# EAGLE design wifi_shield (EAGLE 9.6.2)
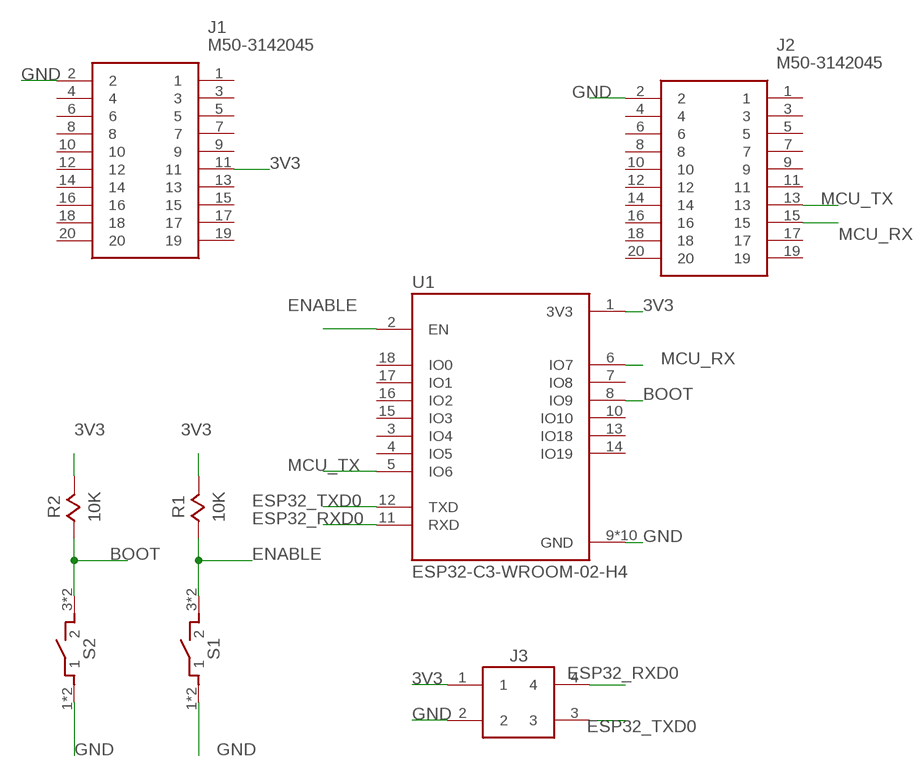
[diagram p0: schematic, sheet 1]

## Parts
J1  M50-3142045  [M503142045]
J2  M50-3142045  [M503142045]
J3  MALE_HEADER_4X1  [4X1_HEADER]
R1  10K  RESISTOR  [0805]
R2  10K  RESISTOR  [0805]
S1  TACTILE-SWITCH  [TACTILE-SWITCH]
S2  TACTILE-SWITCH  [TACTILE-SWITCH]
U1  ESP32-C3-WROOM-02-H4  [MODULE_ESP32-C3-WROOM-02-H4]

## Nets
3V3: J1.11 J3.1 R1.2 R2.2 U1.1(3V3)
BOOT: R2.1 S2.3 S2.4 U1.8(IO9)
ENABLE: R1.1 S1.3 S1.4 U1.2(EN)
ESP32_RXD0: J3.4 U1.11(RXD)
ESP32_TXD0: J3.3 U1.12(TXD)
GND: J1.2 J2.2 J3.2 S1.1 S1.2 S2.1 S2.2 U1.9(GND) U1.19(GND) U1.20(GND) U1.21(GND) U1.22(GND) U1.23(GND) U1.24(GND) U1.25(GND) U1.26(GND) U1.27(GND)
MCU_RX: J2.15 U1.6(IO7)
MCU_TX: J2.13 U1.5(IO6)
Unconnected: J1.1 J1.3 J1.4 J1.5 J1.6 J1.7 J1.8 J1.9 J1.10 J1.12 J1.13 J1.14 J1.15 J1.16 J1.17 J1.18 J1.19 J1.20 J2.1 J2.3 J2.4 J2.5 J2.6 J2.7 J2.8 J2.9 J2.10 J2.11 J2.12 J2.14 J2.16 J2.17 J2.18 J2.19 J2.20 U1.3(IO4) U1.4(IO5) U1.7(IO8) U1.10(IO10) U1.13(IO18) U1.14(IO19) U1.15(IO3) U1.16(IO2) U1.17(IO1) U1.18(IO0)

## Library data of the parts
J1 J2 = esp32_shield:M50-3142045: Headers & Wire Housings 20 WAY SIL VERT SMT SKT Source: Datasheet <https://componentsearchengine.com/Datasheets/1/M50-3142045.pdf>; DESCRIPTION: Headers & Wire Housings 20 WAY SIL VERT SMT SKT; HEIGHT: 3.6mm; MANUFACTURER_NAME: Harwin; MANUFACTURER_PART_NUMBER: M50-3142045; MOUSER_PART_NUMBER: 855-M50-3142045; MOUSER_PRICE-STOCK: https://www.mouser.co.uk/ProductDetail/Harwin/M50-3142045/?qs=%252BdQmOuGyFcFpETieNSWjAg%3D%3D
J3 = esp32_shield:MALE_HEADER_4X1
R1 R2 = esp32_shield:RESISTOR
S1 S2 = esp32_shield:TACTILE-SWITCH: 612-TL3365AF180QG
U1 = esp32_shield:ESP32-C3-WROOM-02-H4: WiFi Modules (802.11) (Engineering Samples) SMD module, ESP32-C3, 4MB SPI flash, PCB antenna, -40 C +105 C; MANUFACTURER: Espressif; MAXIMUM_PACKAGE_HEIGHT: 3.35 mm; PARTREV: V1.0; STANDARD: Manufacturer Recommendations

## Board
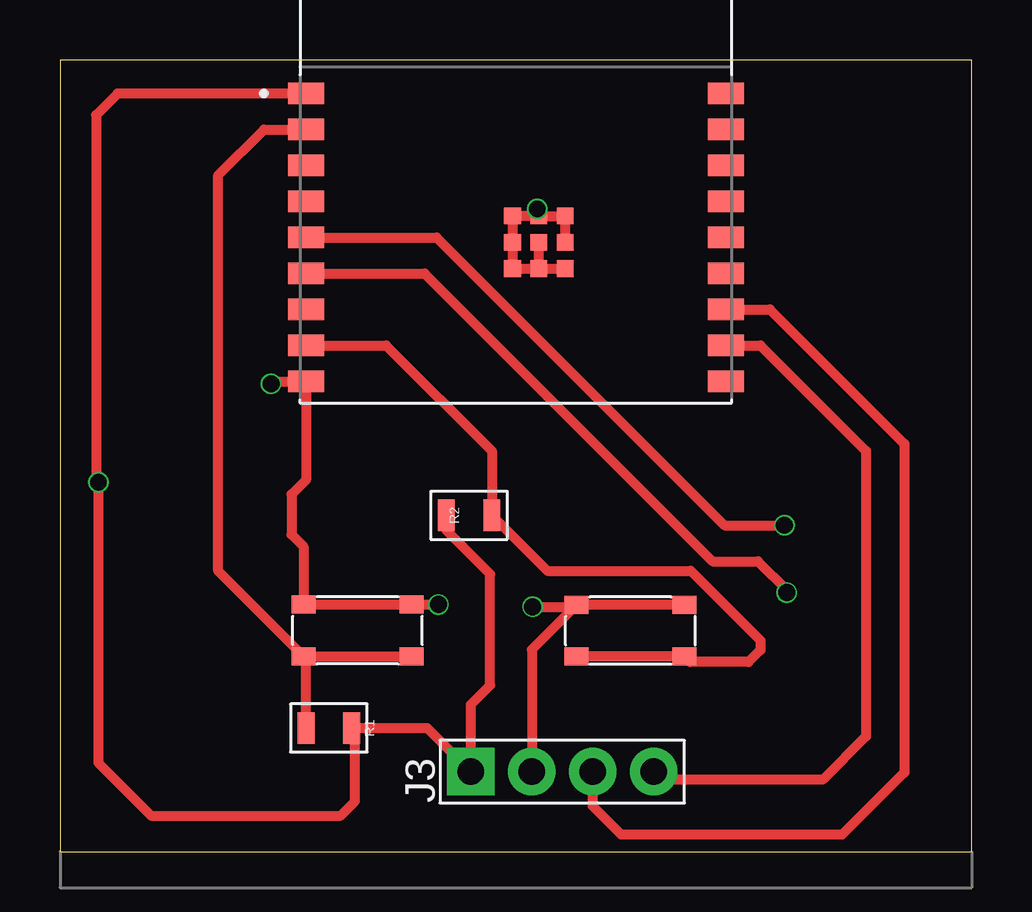
[diagram p1: board, top side]
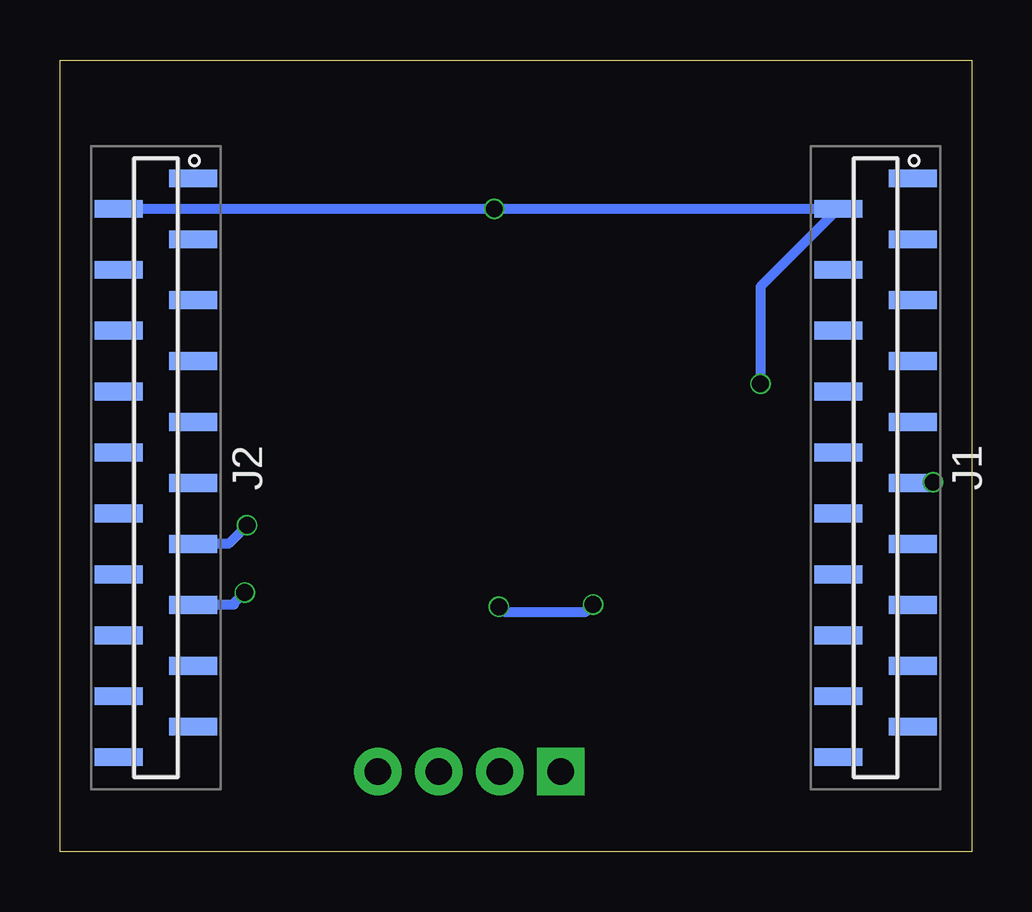
[diagram p2: board, bottom side, seen from below]

Size 38 x 33 mm. Coordinates in mm from the lower left corner, seen from the top.
Outline: 0,0 38,0 38,33 0,33 0,0
Copper layers (1*16): Top 0.035mm / dielectric 1.6mm / Bottom 0.035mm
Design rules "jlc_pcb": minimum track width 5mil, minimum drill 0.3mm, track to track 5mil, track to pad 5mil, pad to pad 5mil, via to via 5mil, smd to smd 5mil, copper to edge 0.2mm, drill to drill 6mil, minimum pad ring 10mil, minimum via ring 3mil, stop-mask expansion 4mil, vias tented up to drill 0mil, thermal gap 10mil

### Footprints (pad centres in the part's own frame; a part is rotated, then mirrored left to right if it is on the bottom)
M503142045 = smd 0.74 x 2: 1 -12.065,1.55; 2 -10.795,-1.55; 3 -9.525,1.55; 4 -8.255,-1.55; 5 -6.985,1.55; 6 -5.715,-1.55; 7 -4.445,1.55; 8 -3.175,-1.55; 9 -1.905,1.55; 10 -0.635,-1.55; 11 0.635,1.55; 12 1.905,-1.55; 13 3.175,1.55; 14 4.445,-1.55; 15 5.715,1.55; 16 6.985,-1.55; 17 8.255,1.55; 18 9.525,-1.55; 19 10.795,1.55; 20 12.065,-1.55
4X1_HEADER = drill 1.1 square: 1 0,3.81 | drill 1.1: 2 0,1.27; 3 0,-1.27; 4 0,-3.81
0805 = smd 0.7 x 1.3: 1 -0.95,0; 2 0.95,0
TACTILE-SWITCH = smd 1 x 0.75: 1 -2.25,-1.075; 2 2.25,-1.075; 3 -2.25,1.075; 4 2.25,1.075
MODULE_ESP32-C3-WROOM-02-H4 = smd 1.5 x 0.9: 1 -8.75,2.9; 2 -8.75,1.4; 3 -8.75,-0.1; 4 -8.75,-1.6; 5 -8.75,-3.1; 6 -8.75,-4.6; 7 -8.75,-6.1; 8 -8.75,-7.6; 9 -8.75,-9.1; 10 8.75,-9.1; 11 8.75,-7.6; 12 8.75,-6.1; 13 8.75,-4.6; 14 8.75,-3.1; 15 8.75,-1.6; 16 8.75,-0.1; 17 8.75,1.4; 18 8.75,2.9 | smd 0.7 x 0.7: 19 -0.14,-2.2; 20 0.96,-2.2; 21 2.06,-2.2; 22 -0.14,-3.3; 23 0.96,-3.3; 24 2.06,-3.3; 25 -0.14,-4.4; 26 0.96,-4.4; 27 2.06,-4.4

### Placement (x,y rotation side)
J1  4,16 270 bottom
J2  34,16 270 bottom
J3  20.94,3.33 90 top
R1  11.21,5.15 0 top
R2  17.05,14.02 180 top
S1  12.4,9.22 180 top
S2  23.78,9.21 180 top
U1  19,28.7 0 top

### Tracks (layer width: path | path; a pad name or v marks a point on that pad's centre or on a via)
3V3  (via drill 0.7)
  Top 0.406: U1.1 2.4,31.6 1.5,30.7 1.5,15.5 v1.6,15.4 1.6,3.7 3.8,1.5 11.7,1.5 12.3,2.1 12.3,5.01 R1.2 15.31,5.15 J3.1 17.13,6.13 17.93,6.93 17.93,11.57 16.1,13.4 R2.2
  Bottom 0.406: J1.11 1.64,15.37 v1.6,15.4
BOOT
  Top 0.406: U1.8 13.6,21.1 18,16.7 R2.1 20.32,11.7 26.3,11.7 29.2,8.8 29.2,8.4 28.7,7.9 26.27,7.9 S2.3 S2.4
ENABLE
  Top 0.406: S1.4 6.6,11.7 6.6,28.2 8.5,30.1 U1.2 | R1.1 10.26,8.04 S1.4 | S1.4 S1.3
ESP32_RXD0
  Top 0.406: U1.11 29.2,21.1 33.6,16.7 33.6,4.8 31.8,3 25.08,3 J3.4
ESP32_TXD0
  Top 0.406: U1.12 29.6,22.6 35.2,17 35.2,3.3 32.6,0.7 23.4,0.7 22.21,1.89 J3.3
GND  (via drill 0.7)
  Top 0.406: v8.8,19.5 8.9,19.6 U1.9 10.25,15.49 9.65,14.89 9.65,13.21 10.15,12.71 S1.2 S1.1 v15.78,10.29 v15.78,10.3 | U1.20 19.96,26.73 v19.9,26.8 | U1.20 U1.19 U1.22 U1.25 U1.26 | U1.20 U1.21 U1.24 | U1.26 U1.27 | U1.26 U1.23 | S2.1 S2.2 | S2.2 19.67,8.43 J3.2 | v19.7,10.2 21.45,10.2 S2.2
  Bottom 0.406: J2.2 v19.9,26.8 J1.2 8.8,23.55 v8.8,19.5 | v19.7,10.2 19.5,10 16.08,10 v15.78,10.3
MCU_RX  (via drill 0.7)
  Top 0.406: U1.6 15.2,24.1 27.2,12.1 29.1,12.1 30.3,10.9 v30.3,10.8
  Bottom 0.406: v30.3,10.8 30.78,10.32 30.75,10.29 J2.15
MCU_TX  (via drill 0.7)
  Top 0.406: U1.5 15.7,25.6 27.7,13.6 v30.2,13.6
  Bottom 0.406: v30.2,13.6 30.98,12.82 J2.13